# Altium project SIM800c.PrjPcb
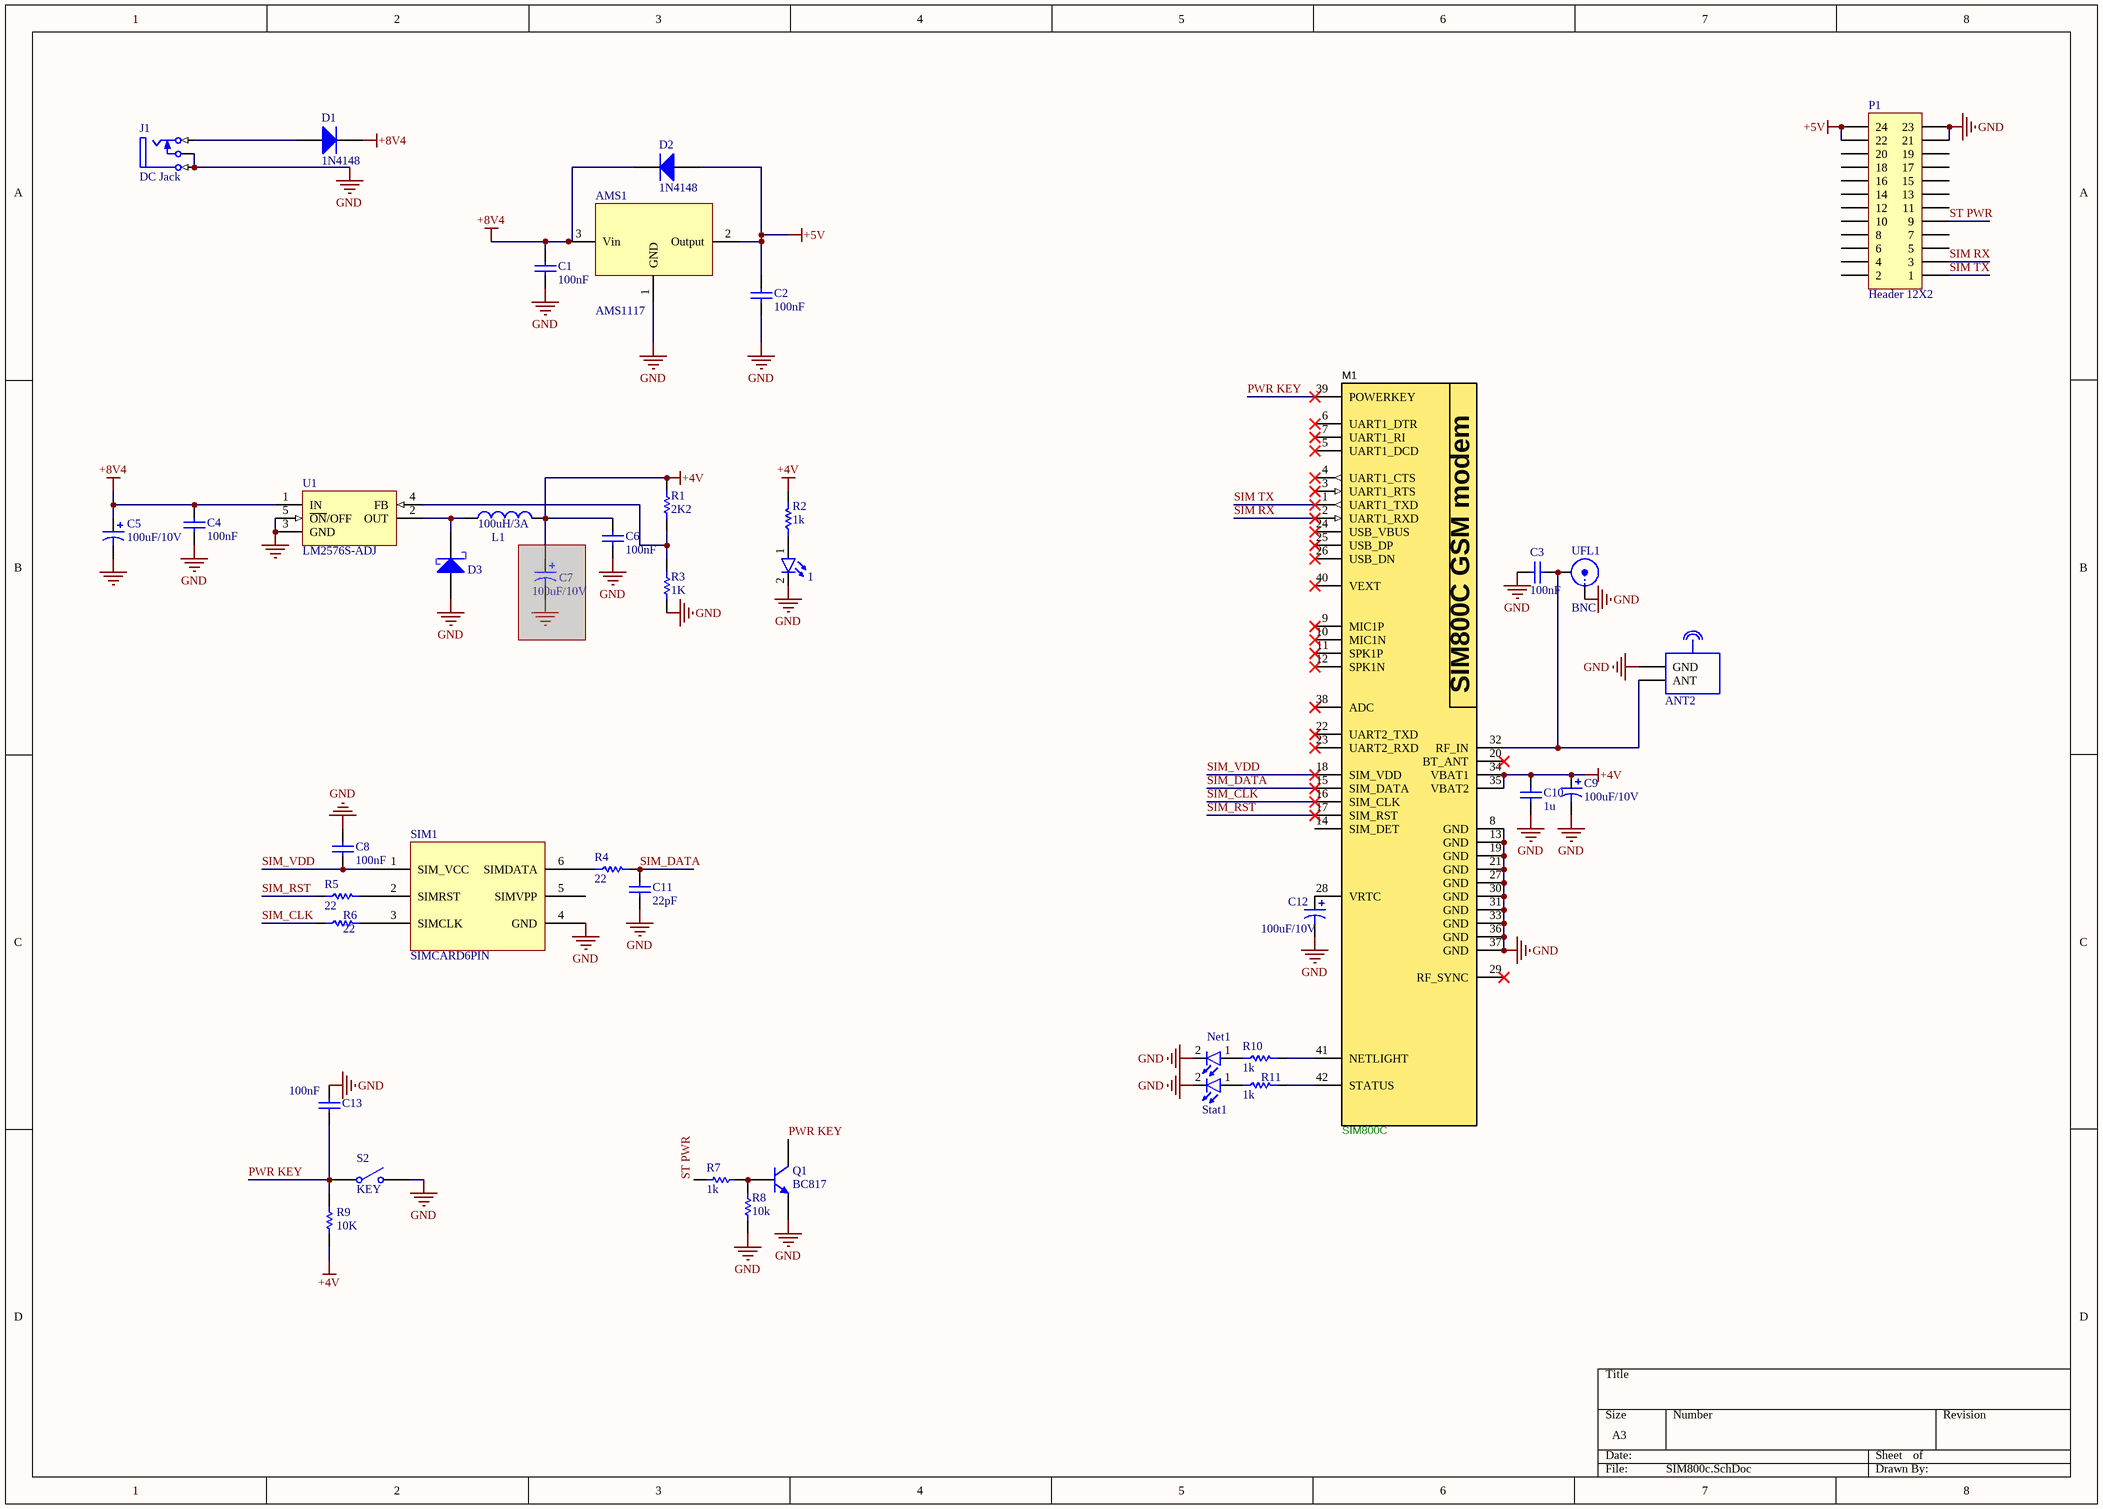
[diagram p0: SIM800c.SchDoc]
1 sheet, 41 parts. Net scope: global (net labels, ports and power ports of the same name join across sheets).
Board file: SIM800.PcbDoc

## Sheet SIM800c.SchDoc
size A3

### Parts
1  Red  [LED SMD 1206]  (value not drawn)
AMS1  AMS1117  [AMS1117 3.3]
ANT2  Antenna  [ANT-R-RF]  (value not drawn)
C1  100nF  [SMD_CAP_1206]
C2  100nF  [SMD_CAP_1206]
C3  100nF  [RAD-0.1]
C4  100nF  [SMD_CAP_1206]
C5  100uF/10V  [CAPMP7343X310N]
C6  100nF  [SMD_CAP_1206]
C7  100uF/10V  [CAPMP7343X310N]  (masked out: inside a compile mask, not in the netlist)
C8  100nF  [SMD_CAP_1206]
C9  100uF/10V  [CAPMP7343X310N]
C10  1u  [SMD_CAP_1206]
C11  22pF  [SMD_CAP_1206]
C12  100uF/10V  [CAPMP3216X180N]
C13  100nF  [SMD_CAP_1206]
D1  1N4148  [LL4148]
D2  1N4148  [LL4148]
D3  SS34 SMD  [SCHOTTKY SMD]  (value not drawn)
J1  DC Jack  [CONN_PWR_JACK_2.1x5.5mm]
L1  100uH/3A  [IND_WW_DR73]
M1  SIM800C  [Sim800c]
Net1  Red  [LED SMD 1206]  (value not drawn)
P1  Header 12X2  [HDR2X12]
Q1  BC817  [sot-23]
R1  2K2  [SMD_RES_1206]
R2  value 1k  [SMD_RES_1206]
R3  1K  [SMD_RES_1206]
R4  22  [SMD_RES_1206]
R5  22  [SMD_RES_1206]
R6  22  [SMD_RES_1206]
R7  1k  [SMD_RES_1206]
R8  10k  [SMD_RES_1206]
R9  10K  [SMD_RES_1206]
R10  value 1k  [SMD_RES_1206]
R11  value 1k  [SMD_RES_1206]
S2  KEY  [SW-SMD]
SIM1  SIMCARD6PIN  [Sim Card]
Stat1  Red  [LED SMD 1206]  (value not drawn)
U1  LM2576S-ADJ  [LM2576_SMD]
UFL1  BNC  [ufl-smd]

### Nets
+4V: C6.1 C9.1 C10.2 L1.2 M1.34(VBAT1) M1.35(VBAT2) R1.2 R2.2 R9.2
+5V: AMS1.2(Output) C2.1 D2.1(A) P1.22 P1.24
+8V4: AMS1.3(Vin) C1.1 C4.1 C5.1 D1.2(K) D2.2(K) U1.1(IN)
GND: 1.2(K) AMS1.1(GND) ANT2.1(GND) C1.2 C2.2 C3.1 C4.2 C5.2 C6.2 C8.1 C9.2 C10.1 C11.2 C12.2 C13.2 D3.1(A) J1.2(TN) J1.3(S) M1.8(GND) M1.13(GND) M1.19(GND) M1.21(GND) M1.27(GND) M1.30(GND) M1.31(GND) M1.33(GND) M1.36(GND) M1.37(GND) Net1.2(K) P1.21 P1.23 Q1.3(E) R3.1 R8.1 S2.2(NO) SIM1.4(GND) Stat1.2(K) U1.3(GND) U1.5(~{ON}/OFF) UFL1.1(X)
PWR KEY: C13.1 M1.39(POWERKEY) Q1.1(C) R9.1 S2.1(COMMON)
SIM RX: M1.2(UART1_RXD) P1.3
SIM TX: M1.1(UART1_TXD) P1.1
SIM_CLK: M1.16(SIM_CLK) R6.1
SIM_DATA: C11.1 M1.15(SIM_DATA) R4.2
SIM_RST: M1.17(SIM_RST) R5.1
SIM_VDD: C8.2 M1.18(SIM_VDD) SIM1.1(SIM_VCC)
ST PWR: P1.9 R7.1
Net1_1: 1.1(A) R2.1
NetANT2_2: ANT2.2(ANT) C3.2 M1.32(RF_IN) UFL1.2(Y)
NetC12_1: C12.1 M1.28(VRTC)
NetD1_1: D1.1(A) J1.1(T)
NetD3_2: D3.2(K) L1.1 U1.2(OUT)
NetM1_41: M1.41(NETLIGHT) R10.2
NetM1_42: M1.42(STATUS) R11.2
NetNet1_1: Net1.1(A) R10.1
NetQ1_2: Q1.2(B) R7.2 R8.2
NetR1_1: R1.1 R3.2 U1.4(FB)
NetR4_1: R4.1 SIM1.6(SIMDATA)
NetR5_2: R5.2 SIM1.2(SIMRST)
NetR6_2: R6.2 SIM1.3(SIMCLK)
NetR11_1: R11.1 Stat1.1(A)

Not connected (* = marked no-connect by the designer): M1 3(UART1_RTS)* 4(UART1_CTS)* 5(UART1_DCD)* 6(UART1_DTR)* 7(UART1_RI)* 9(MIC1P)* 10(MIC1N)* 11(SPK1P)* 12(SPK1N)* 14(SIM_DET) 20(BT_ANT)* 22(UART2_TXD)* 23(UART2_RXD)* 24(USB_VBUS)* 25(USB_DP)* 26(USB_DN)* 29(RF_SYNC)* 38(ADC)* 40(VEXT)*; P1 2 4 5 6 7 8 10 11 12 13 14 15 16 17 18 19 20; SIM1 5(SIMVPP)

### Notes on the sheet
- (in symbol SIM800C) SIM800C GSM modem

### Library data of the parts
1 Net1 Stat1 = LED: Designer: Saeid Jorablo; Organazation: ControTec; Adding Date: 1387/12/22; Color: Red; Size: SMD 1206
ANT2 = Antenna: Right RF Antenna; Designer: Seyed Mohsen Ghasemian; E-mail: picpars@gmail.com; ComponentLinkURL: www.picpars.com; Make: 11/22/2013
C1-C4 C6 C8 C10 C11 C13 = Cap: Capacitor; Published: 8-Jun-2000; Publisher: Altium Limited
  C1-C4 C6 C8: Revision: July-2002: Re-released for DXP Platform.; Value: 100nF
  C10: Revision: July-2002: Re-released for DXP Platform.; Value: 1u
  C11: Revision: July-2002: Re-released for DXP Platform.; Value: 22pF
  C13: LatestRevisionDate: 17-Jul-2002; LatestRevisionNote: Re-released for DXP Platform.; PackageReference: RAD-0.3; Value: 100nF
C5 C7 C9 C12 = Cap Pol1: Polarized Capacitor (Radial); Published: 8-Jun-2000; LatestRevisionDate: 17-Jul-2002; LatestRevisionNote: Re-released for DXP Platform.; PackageReference: RB7.6-15; Publisher: Altium Limited; Value: 100uF/10V
D1 D2 = Diode 1N4148: High Conductance Fast Diode; Published: 8-Jun-2000; LatestRevisionDate: 17-Jul-2002; LatestRevisionNote: Re-released for DXP Platform.; DatasheetVersion: 1997; PackageReference: DO-35; Publisher: Altium Limited; PackageDescription: Diode, Axial; Body 3.8 x 1.9 mm (LxDia. max), Lead Dia. 0.53 mm (max); Code_JEDEC: DO-204-AH; ComponentLink1Description: Manufacturer Link; ComponentLink1URL: http://www.fairchildsemi.com/; ComponentLink2Description: Datasheet; ComponentLink2URL: http://www.fairchildsemi.com/ds/1N%2F1N4148.pdf
D3 = SS34_SCHOTTKY SMD: SCHOTTKY RECTIFIER SMD
J1 = DC Jack: PackageDocument: 2003; PCB_Layout: Complies with manufacturer's recommendation.; DrillAndSlotSize: Corresponds to nominal value.; LatestRevisionDate: 15-Jul-2004; LatestRevisionNote: Component Replaced & renamed from "Phonejack".; DatasheetDocument: 2003; PackageReference: S1VS_SNB; Publisher: Altium Limited; ComponentLink1Description: Manufacturer Link; ComponentLink1URL: http://www.cliffuk.co.uk/
L1 = INDUCTOR
P1 = Header 12X2: Header, 12-Pin, Dual row; LatestRevisionDate: 17-Jul-2002; LatestRevisionNote: Re-released for DXP Platform.; Publisher: Altium Limited
Q1 = NPN: NPN Bipolar Transistor; pin to pad: 1>3 2>1 3>2; Published: 8-Jun-2000; LatestRevisionDate: 17-Jul-2002; LatestRevisionNote: Re-released for DXP Platform.; PackageReference: TO-226; Publisher: Altium Limited; Code_JEDEC: TO-226-AA
R1 R3 R7-R9 = Res Semi: Semiconductor Resistor; Published: 8-Jun-2000; LatestRevisionDate: 17-Jul-2002; LatestRevisionNote: Re-released for DXP Platform.; PackageReference: AXIAL-0.5; Publisher: Altium Limited
  R1: Value: 2K2
  R3: Value: 1K
  R7: Value: 1k
  R8: Value: 10k
  R9: Value: 10K
R2 R10 R11 = Resistor: Tolerance: 5%; Power: 1/8 W
R4-R6 = Resistor: Value: 22
S2 = SW-SPST: Single-Pole, Single-Throw Switch; Published: 24-Mar-1999; LatestRevisionDate: 17-Jul-2002; LatestRevisionNote: Re-released for DXP Platform.; PackageReference: SPST-2; Publisher: Altium Limited; PackageDescription: Switch; 2 Leads
U1 = LM2576S-5.0: Simple Switcher 3A Step Down Voltage Regulator; Note: Tab is connected to GND; Published: 15-Apr-2002; DatasheetVersion: Jun-1999; PackageReference: TS5B; Publisher: Altium Limited; PackageDescription: D2-PAK; 5 Leads; Body 14.4 (inc. leads) x 10.4 mm (LxW max); ComponentLink1Description: Manufacturer Link; ComponentLink1URL: http://www.national.com/; ComponentLink2Description: Datasheet; ComponentLink2URL: http://www.national.com/ds.cgi/LM/LM2576.pdf; ComponentLink3Description: URL Link1; ComponentLink3URL: http://www.national.com/pf/LM/LM2576.html
UFL1 = BNC: BNC Elbow Connector; LatestRevisionDate: 17-Jul-2002; LatestRevisionNote: Re-released for DXP Platform.; Publisher: Altium Limited